# Altium project Shuttler_AMC.PrjPcb (part 2 of 20)

## Sheet USB_SERIAL_QUAD.SchDoc: =ProjectName
size 420 x 297 mm; Author: T.P.; CompanyName: WUT; DrawnBy: T.P.; Organization: WUT ISE; Address1: Warsaw Univeristy of Technology; Address2: Nowowiejska 15/19; DocumentNumber: 21; Revision: 0.9; SheetNumber: 21; SheetTotal: 36; EDA_Number: ARTIQ; Projet: ARTIQ/SINARA; ModifiedBy: -; CreateDate: XX/XX/XXXX; CheckedDate: -; Title2: USB_SERIAL_QUAD.SchDoc; DivGrp: ISE; Designer: G.K. and T.P.; ModifiedDate: -; ProjectName: ADC/DAC MEZZANINE
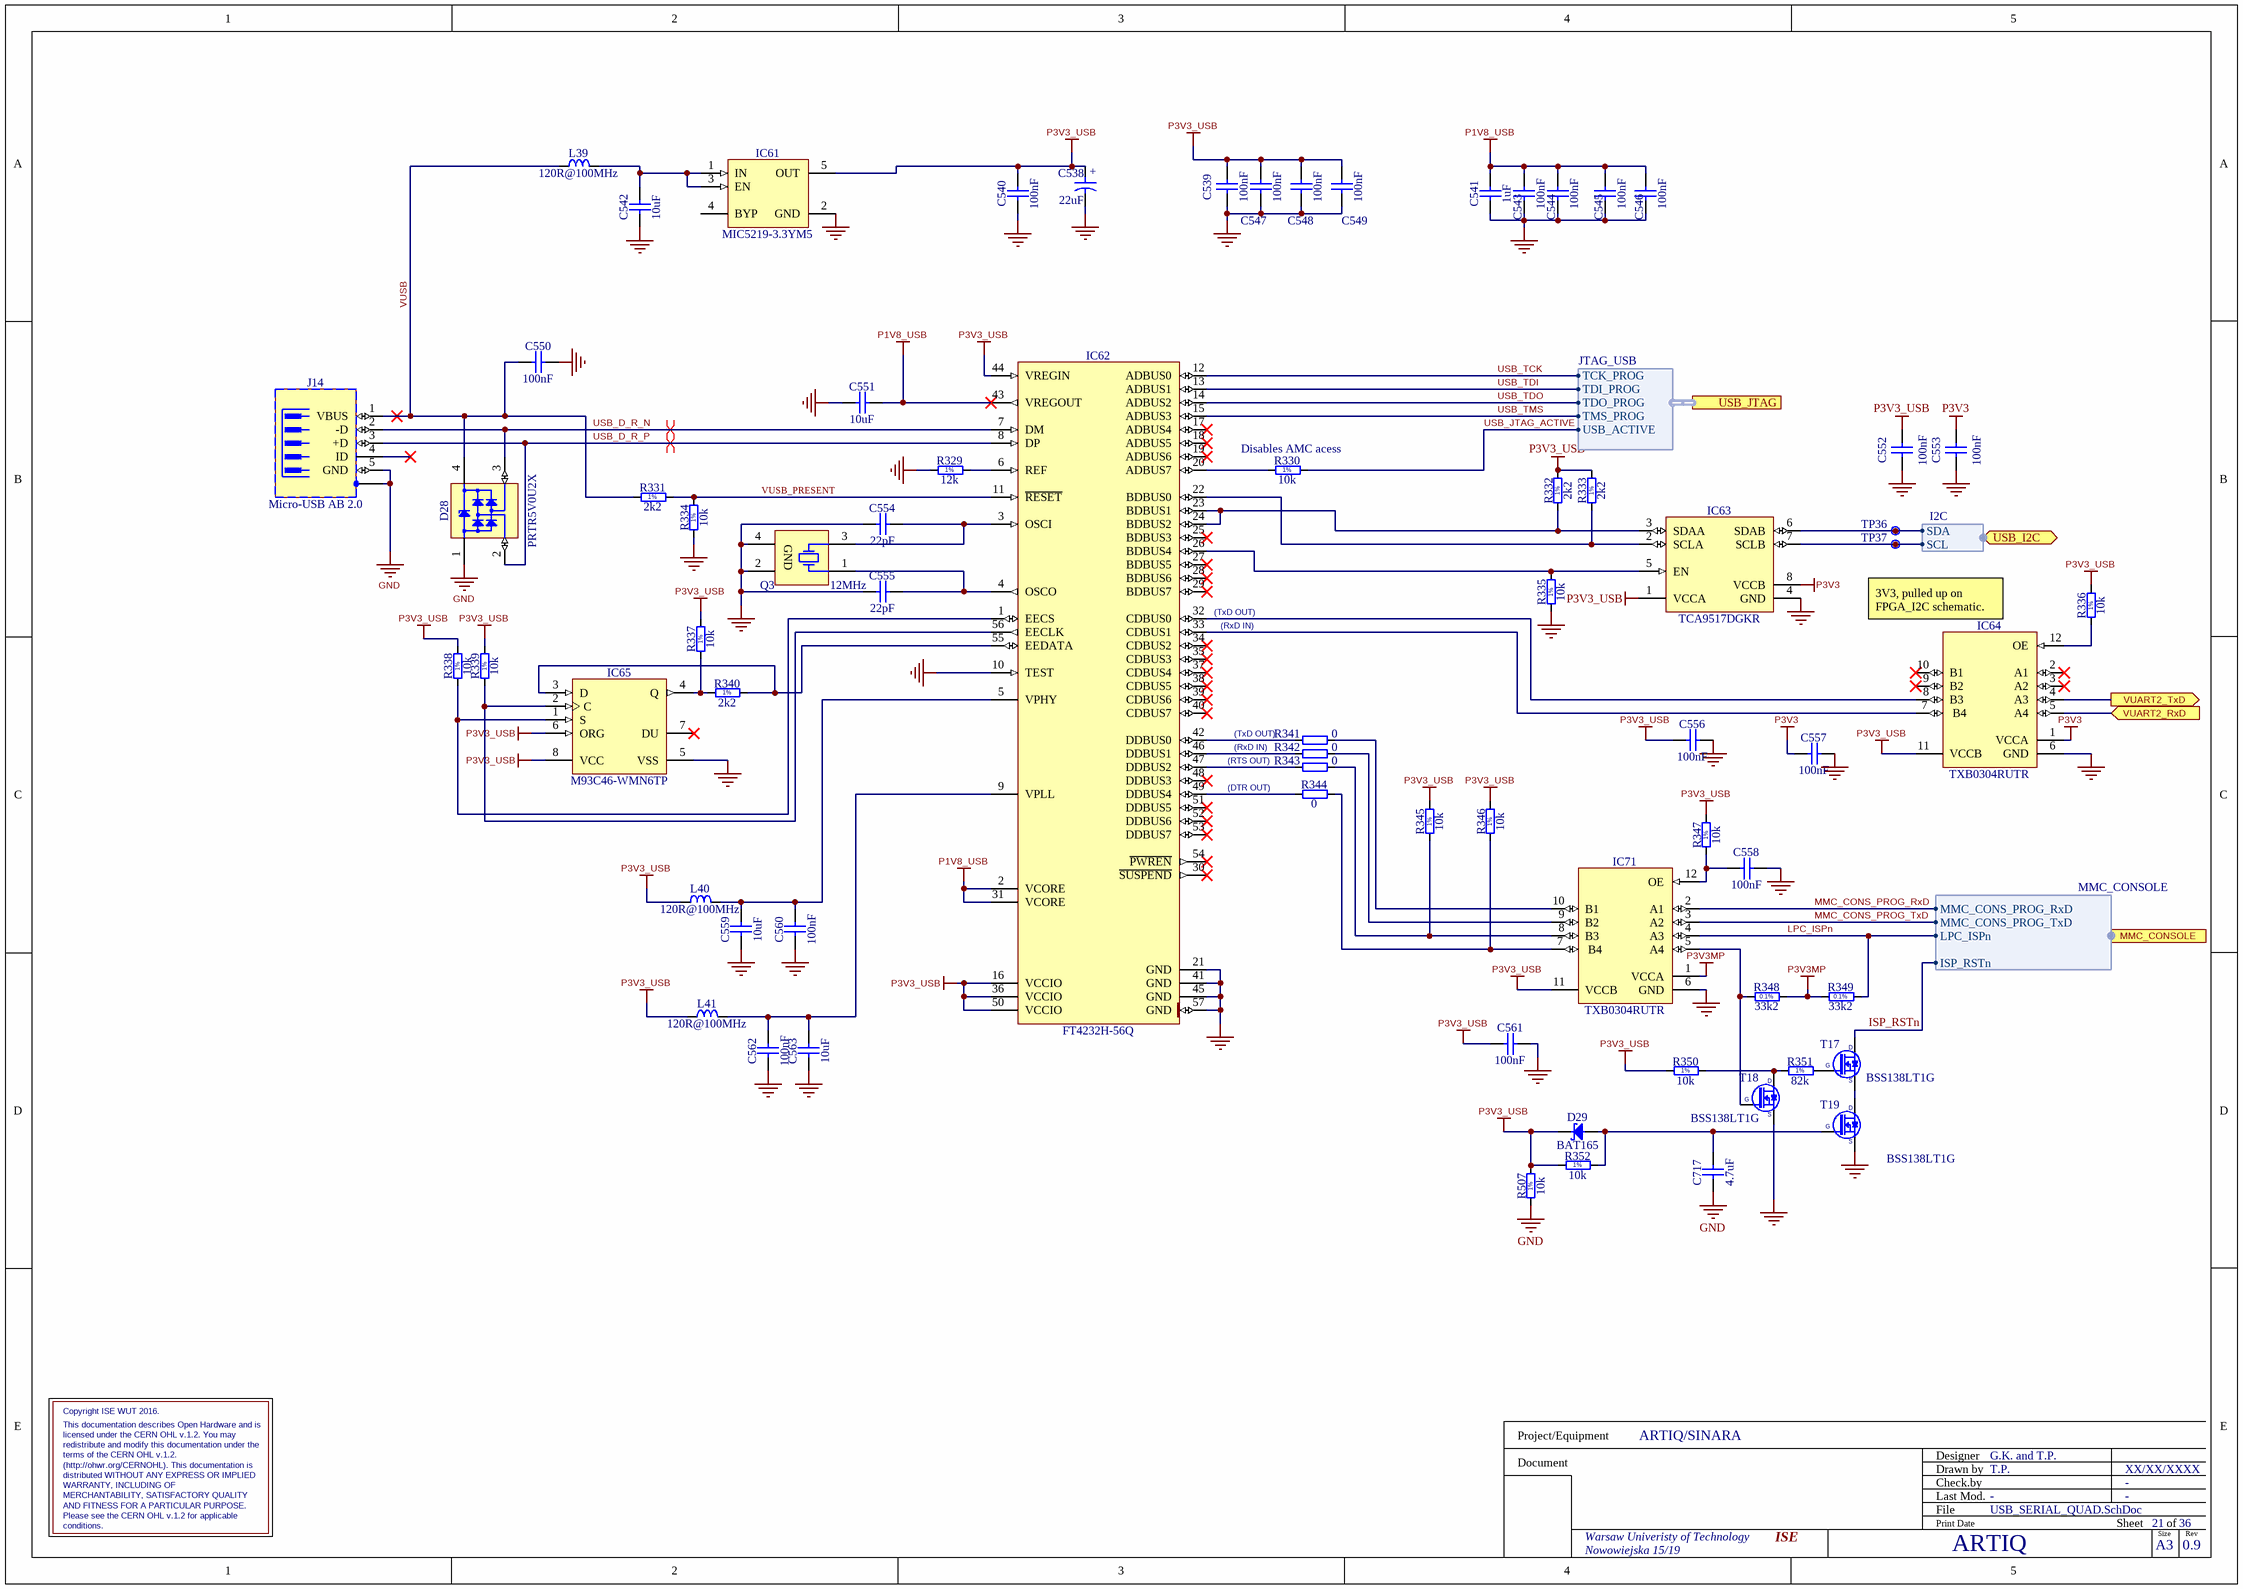
[diagram p1: USB_SERIAL_QUAD.SchDoc]

### Parts
C538  22uF  [CAPMP3216X180N]
C539  100nF  [CAPC0603X33N]
C540  100nF  [CAPC0603X33N]
C541  1uF  [CAPC1005X55N]
C542  10uF  [CAPC1608X87N]
C543  100nF  [CAPC0603X33N]
C544  100nF  [CAPC0603X33N]
C545  100nF  [CAPC0603X33N]
C546  100nF  [CAPC0603X33N]
C547  100nF  [CAPC0603X33N]
C548  100nF  [CAPC0603X33N]
C549  100nF  [CAPC0603X33N]
C550  100nF  [CAPC0603X33N]
C551  10uF  [CAPC1608X87N]
C552  100nF  [CAPC0603X33N]
C553  100nF  [CAPC0603X33N]
C554  22pF  [CAPC1005X55N]
C555  22pF  [CAPC1005X55N]
C556  100nF  [CAPC0603X33N]
C557  100nF  [CAPC0603X33N]
C558  100nF  [CAPC0603X33N]
C559  10uF  [CAPC1608X87N]
C560  100nF  [CAPC0603X33N]
C561  100nF  [CAPC0603X33N]
C562  100nF  [CAPC0603X33N]
C563  10uF  [CAPC1608X87N]
C717  4.7uF  [CAPC1005X55N]
D28  PRTR5V0U2X  [SOT190P230X110-4N]
D29  BAT165  [SOD2512X110N]
IC61  MIC5219-3.3YM5  [SOT95P280X145-5N]
IC62  FT4232H-56Q  [QFN50P800X800X100-57N-S620]
IC63  TCA9517DGKR  [SOP65P490X110-8N]
IC64  TXB0304RUTR  [TEXAS_RUT (R-PUQFN-N12)]
IC65  M93C46-WMN6TP  [SOIC127P600X175-8N]
IC71  TXB0304RUTR  [TEXAS_RUT (R-PUQFN-N12)]
J14  Micro-USB AB 2.0  [HIROSE_ZX62RD-AB-5P8]
L39  120R@100MHz  [INDC1608X65N]
L40  120R@100MHz  [INDC1608X65N]
L41  120R@100MHz  [INDC1608X65N]
Q3  12MHz  [XTAL_TXC_7M]
R329  12k  [RESC1005X40N]
R330  10k  [RESC1005X40N]
R331  2k2  [RESC1005X40N]
R332  2k2  [RESC1005X40N]
R333  2k2  [RESC1005X40N]
R334  10k  [RESC1005X40N]
R335  10k  [RESC1005X40N]
R336  10k  [RESC1005X40N]
R337  10k  [RESC1005X40N]
R338  10k  [RESC1005X40N]
R339  10k  [RESC1005X40N]
R340  2k2  [RESC1005X40N]
R341  0  [RESC1005X40N]
R342  0  [RESC1005X40N]
R343  0  [RESC1005X40N]
R344  0  [RESC1005X40N]
R345  10k  [RESC1005X40N]
R346  10k  [RESC1005X40N]
R347  10k  [RESC1005X40N]
R348  33k2  [RESC1608X55N]
R349  33k2  [RESC1608X55N]
R350  10k  [RESC1005X40N]
R351  82k  [RESC1005X40N]
R352  10k  [RESC1005X40N]
R507  10k  [RESC1005X40N]
T17  BSS138LT1G  [SOT95P240X110-3N]
T18  BSS138LT1G  [SOT95P240X110-3N]
T19  BSS138LT1G  [SOT95P240X110-3N]
TP36  USB I2C SDA  [TPS127]  (value not drawn)
TP37  USB I2C SCL  [TPS127]  (value not drawn)

### Ports
MMC_CONSOLE (harness MMC_CONSOLE), USB_I2C (bidir, harness I2C), USB_JTAG (harness JTAG_USB), VUART2_RxD (in), VUART2_TxD (out)

### Harnesses
JTAG_USB: TDO_PROG, TDI_PROG, TCK_PROG, TMS_PROG, USB_ACTIVE
MMC_CONSOLE: MMC_CONS_PROG_RxD, MMC_CONS_PROG_TxD, LPC_ISPn, ISP_RSTn
I2C: SCL, SDA

### Nets
GND: C538.2 C539.1 C540.1 C541.1 C542.1 C543.1 C544.1 C545.1 C546.1 C547.1 C548.1 C549.1 C550.1 C551.2 C552.1 C553.1 C554.1 C555.1 C556.1 C557.1 C558.1 C559.1 C560.1 C561.1 C562.1 C563.1 C717.1 D28.1(GND) IC61.2(GND) IC62.10(TEST) IC62.21(GND) IC62.41(GND) IC62.45(GND) IC62.57(GND) IC63.4(GND) IC64.6(GND) IC65.5(VSS) IC71.6(GND) J14.5(GND) J14.6(SH) Q3.2(GND) Q3.4(GND) R329.1 R334.1 R335.1 R507.1 T18.2(S) T19.2(S)
P1V8_USB: C541.2 C543.2 C544.2 C545.2 C546.2 C551.1 IC62.2(VCORE) IC62.31(VCORE) IC62.43(VREGOUT)
P3V3: C553.2 C557.2 IC63.8(VCCB) IC64.1(VCCA)
P3V3_USB: C538.1 C539.2 C540.2 C547.2 C548.2 C549.2 C552.2 C556.2 C561.2 D29.1(C) IC61.5(OUT) IC62.16(VCCIO) IC62.36(VCCIO) IC62.44(VREGIN) IC62.50(VCCIO) IC63.1(VCCA) IC64.11(VCCB) IC65.6(ORG) IC65.8(VCC) IC71.11(VCCB) L40.1 L41.1 R332.2 R333.2 R336.2 R337.2 R338.2 R339.2 R345.2 R346.2 R347.2 R350.1 R352.1 R507.2
P3V3MP: IC71.1(VCCA) R348.1 R349.2
FPGA_I2C.SCL: IC63.7(SCLB) TP37.1 ; port USB_I2C.SCL
FPGA_I2C.SDA: IC63.6(SDAB) TP36.1 ; port USB_I2C.SDA
ISP_RSTn: T17.3(D) ; port MMC_CONSOLE.ISP_RSTn  [project net MMC_CONSOLE.ISP_RSTn]
LPC_ISPn: IC71.4(A3) R349.1 ; port MMC_CONSOLE.LPC_ISPn  [project net MMC_CONSOLE.LPC_ISPn]
MMC_CONS_PROG_RxD: IC71.2(A1) ; port MMC_CONSOLE.MMC_CONS_PROG_RxD  [project net MMC_CONSOLE.MMC_CONS_PROG_RxD]
MMC_CONS_PROG_TxD: IC71.3(A2) ; port MMC_CONSOLE.MMC_CONS_PROG_TxD  [project net MMC_CONSOLE.MMC_CONS_PROG_TxD]
PRI_UART_RxD: IC64.4(A3) ; port VUART2_TxD
PRI_UART_TxD: IC64.5(A4) ; port VUART2_RxD
USB_D_R_N: D28.3(I/O2) IC62.7(DM) J14.2(-D)
USB_D_R_P: D28.2(I/O1) IC62.8(DP) J14.3(+D)
USB_JTAG_ACTIVE: R330.1 ; port USB_JTAG.USB_ACTIVE  [project net USB_JTAG.USB_ACTIVE]
USB_TCK: IC62.12(ADBUS0) ; port USB_JTAG.TCK_PROG  [project net USB_JTAG.TCK_PROG]
USB_TDI: IC62.13(ADBUS1) ; port USB_JTAG.TDI_PROG  [project net USB_JTAG.TDI_PROG]
USB_TDO: IC62.14(ADBUS2) ; port USB_JTAG.TDO_PROG  [project net USB_JTAG.TDO_PROG]
USB_TMS: IC62.15(ADBUS3) ; port USB_JTAG.TMS_PROG  [project net USB_JTAG.TMS_PROG]
VUSB: C550.2 D28.4(VCC) J14.1(VBUS) L39.1 R331.1
VUSB_PRESENT: IC62.11(~{RESET}) R331.2 R334.2
NetC542_2: C542.2 IC61.1(IN) IC61.3(EN) L39.2
NetC554_2: C554.2 IC62.3(OSCI) Q3.3(X)
NetC555_2: C555.2 IC62.4(OSCO) Q3.1(X)
NetC558_2: C558.2 IC71.12(OE) R347.1
NetC559_2: C559.2 C560.2 IC62.5(VPHY) L40.2
NetC562_2: C562.2 C563.2 IC62.9(VPLL) L41.2
NetC717_2: C717.2 D29.2(A) R352.2 T19.1(G)
NetIC62_1: IC62.1(EECS) IC65.1(S) R338.1
NetIC62_6: IC62.6(REF) R329.2
NetIC62_20: IC62.20(ADBUS7) R330.2
NetIC62_22: IC62.22(BDBUS0) IC63.2(SCLA) R333.1
NetIC62_23: IC62.23(BDBUS1) IC62.24(BDBUS2) IC63.3(SDAA) R332.1
NetIC62_26: IC62.26(BDBUS4) IC63.5(EN) R335.2
NetIC62_32: IC62.32(CDBUS0) IC64.8(B3)
NetIC62_33: IC62.33(CDBUS1) IC64.7(B4)
NetIC62_42: IC62.42(DDBUS0) R341.1
NetIC62_46: IC62.46(DDBUS1) R342.1
NetIC62_47: IC62.47(DDBUS2) R343.1
NetIC62_49: IC62.49(DDBUS4) R344.1
NetIC62_55: IC62.55(EEDATA) IC65.3(D) R340.2
NetIC62_56: IC62.56(EECLK) IC65.2(C) R339.1
NetIC64_12: IC64.12(OE) R336.1
NetIC65_4: IC65.4(Q) R337.1 R340.1
NetIC71_5: IC71.5(A4) R348.2 T18.1(G)
NetIC71_7: IC71.7(B4) R344.2 R346.1
NetIC71_8: IC71.8(B3) R343.2 R345.1
NetIC71_9: IC71.9(B2) R342.2
NetIC71_10: IC71.10(B1) R341.2
NetR350_2: R350.2 R351.1 T18.3(D)
NetR351_2: R351.2 T17.1(G)
NetT17_2: T17.2(S) T19.3(D)

Not connected (* = marked no-connect by the designer): IC61 4(BYP); IC62 17(ADBUS4)* 18(ADBUS5)* 19(ADBUS6)* 25(BDBUS3)* 27(BDBUS5)* 28(BDBUS6)* 29(BDBUS7)* 30(~{SUSPEND})* 34(CDBUS2)* 35(CDBUS3)* 37(CDBUS4)* 38(CDBUS5)* 39(CDBUS6)* 40(CDBUS7)* 48(DDBUS3)* 51(DDBUS5)* 52(DDBUS6)* 53(DDBUS7)* 54(~{PWREN})*; IC64 2(A1)* 3(A2)* 9(B2)* 10(B1)*; IC65 7(DU)*; J14 4(ID)*

### Layout directives
differential pair; differential pair class Diff_90Ohm: USB_D_R_N, USB_D_R_P

### Notes on the sheet
- (near R330) Disables AMC acess
- (near IC62) (TxD OUT)
- (near IC62) (RxD IN)
- 3V3, pulled up on FPGA_I2C schematic.
- (DTR OUT)
- (RTS OUT)
- (RxD IN)
- (TxD OUT)
- Copyright ISE WUT 2016.
- redistribute and modify this documentation under the
- licensed under the CERN OHL v.1.2. You may
- This documentation describes Open Hardware and is
- (http://ohwr.org/CERNOHL). This documentation is
- distributed WITHOUT ANY EXPRESS OR IMPLIED
- WARRANTY, INCLUDING OF
- terms of the CERN OHL v.1.2.
- AND FITNESS FOR A PARTICULAR PURPOSE.
- conditions.
- MERCHANTABILITY, SATISFACTORY QUALITY
- Please see the CERN OHL v.1.2 for applicable
- Project/Equipment
- Document
- Designer
- Drawn by
- Check.by
- File
- Last Mod.
- Print Date
- Sheet
- Size
- A3
- of
- Rev
- (in symbol CTE3216-18_22UF_6.3V_10%_LESR0900) +
- (in symbol R0402_2K2_1%_0.0625W_100PPM) 1%
- (in symbol R0402_10K_1%_0.0625W_100PPM) 1%
- (in symbol R0402_12K_1%_0.0625W_100PPM) 1%
- (in symbol R0402_82K_1%_0.0625W_100PPM) 1%
- (in symbol R0603_33K2_0.1%_0.063W_10PPM) 0.1%

### Library data of the parts
C538 = CTE3216-18_22UF_6.3V_10%_LESR0900: Polarised capacitor; Manufacturer: GENERIC; Part Description: Low ESR 0R9 Solid Tantalum Chip Capacitor; Manufacturer1 Part Number: TPSA226K006R0900; Tolerance: ±10%; Voltage: 6.3V; Manufacturer Part Number: CTE3216-18_22UF_6.3V_10%_LESR0900; Part Number: CTE3216-18_22UF_6.3V_10%_LESR0900; Value: 22uF; Component Kind: Standard; Component Type: Standard; Pin Count: 2; Status: Preferred; Case: A; Mounted: Yes; Socket: No; SMD: Yes; Sense: No; Manufacturer1 Example: AVX; Manufacturer1 ComponentHeight: 1.8mm; HelpURL: \\cern.ch\dfs\Applications\Altium\Datasheets\CTE-LESR_AVX_TPS.pdf; Author: CERN DEM JLC; CreateDate: 05.05.2008; LatestRevisionDate: 20.01.2009
C539 C540 C543-C550 C556-C558 C560-C562 = CC0201_100NF_6.3V_10%_X5R: as C696 on sheet Shuttler_AMC; Manufacturer Part Number: CC0201_100NF_6.3V_10%_X5R; Part Number: CC0201_100NF_6.3V_10%_X5R; Value: 100nF; Component Kind: Standard; Component Type: Standard; Pin Count: 2; Status: Not Recommended; Case: 0201; Mounted: Yes; Socket: No; SMD: Yes; Sense: No; Manufacturer1 Example: AVX; Manufacturer1 ComponentHeight: 0.33mm; HelpURL: \\cern.ch\dfs\Applications\Altium\Datasheets\CC0201_X5R_AVX.pdf; Author: CERN DEM JLC; CreateDate: 03.12.2007; LatestRevisionDate: 03.12.2007
C541 = CC0402_1UF_16V_10%_X5R: Non-polarised capacitor; Manufacturer: GENERIC; Part Description: SMD Multilayer Chip Ceramic Capacitor; Manufacturer1 Part Number: C1005X5R1C105KT; Tolerance: ±10%; Voltage: 16V; TC: X5R; Manufacturer Part Number: CC0402_1UF_16V_10%_X5R; Part Number: CC0402_1UF_16V_10%_X5R; Value: 1uF; Component Kind: Standard; Component Type: Standard; Pin Count: 2; Status: Preferred; Case: 0402; Mounted: Yes; Socket: No; SMD: Yes; Sense: No; Manufacturer1 Example: TDK; Manufacturer1 ComponentHeight: 0.55mm; HelpURL: \\cern.ch\dfs\Applications\Altium\Datasheets\CC0402_X5R_TDK_C.pdf; Author: CERN DEM JLC; CreateDate: 25.10.2012; LatestRevisionDate: 25.10.2012
C542 C551 C559 C563 = CC0603_10uF_6.3V_20%_X5R: Non-polarised capacitor; Manufacturer: GENERIC; Manufacturer1 Part Number: C0603C106M9PAC; Part Description: SMD Multilayer Chip Ceramic Capacitor; TC: X5R; Tolerance: ±20%; Voltage: 6.3V; Author: CERN DEM JLC; Case: 0603; Component Kind: Standard; Component Type: Standard; CreateDate: 03.12.2007; HelpURL: \\cern.ch\dfs\Applications\Altium\Datasheets\CC0603_X5R_KEMET.pdf; LatestRevisionDate: 03.12.2007; Manufacturer Part Number: CC0603_10uF_6.3V_20%_X5R; Manufacturer1 ComponentHeight: 0.95mm; Manufacturer1 Example: KEMET; Mounted: Yes; Part Number: CC0603_10UF_6.3V_20%_X5R; Pin Count: 2; SMD: Yes; Socket: No; Status: Preferred; Value: 10uF; Sense: No
C552 C553 = CC0201_100NF_6.3V_10%_X5R: Non-polarised capacitor; Part Description: SMD Multilayer Chip Ceramic Capacitor; Manufacturer: GENERIC; Manufacturer1 Part Number: 02016D104KAT2A; Voltage: 6.3V; TC: X5R; Tolerance: ±10%; Part Number: CC0201_100NF_6.3V_10%_X5R; Component Kind: Standard; Component Type: Standard; Pin Count: 2; Value: 100nF; Status: Not Recommended; Manufacturer Part Number: CC0201_100NF_6.3V_10%_X5R; Case: 0201; Mounted: Yes; Socket: No; SMD: Yes; Sense: No; Manufacturer1 Example: AVX; Manufacturer1 ComponentHeight: 0.33mm; HelpURL: \\cern.ch\dfs\Applications\Altium\Datasheets\CC0201_X5R_AVX.pdf; Author: CERN DEM JLC; CreateDate: 2007-12-03; LatestRevisionDate: 2007-12-03
C554 C555 = CC0402_22PF_50V_5%_C0G: Non-polarised capacitor; Manufacturer: GENERIC; Part Description: SMD Multilayer Chip Ceramic Capacitor; Manufacturer1 Part Number: C0402C220J5GACTU; Tolerance: ±5%; Voltage: 50V; TC: C0G/NP0; Manufacturer Part Number: CC0402_22PF_50V_5%_C0G; Part Number: CC0402_22PF_50V_5%_C0G; Value: 22pF; Component Kind: Standard; Component Type: Standard; Pin Count: 2; Status: Preferred; Case: 0402; Mounted: Yes; Socket: No; SMD: Yes; Sense: No; Manufacturer1 Example: KEMET; Manufacturer1 ComponentHeight: 0.55mm; HelpURL: \\cern.ch\dfs\Applications\Altium\Datasheets\CC0805_C0G_KEMET_(Commercial Grade).pdf; Author: CERN DEM JLC; CreateDate: 03.12.2007; LatestRevisionDate: 03.12.2007
C717 = CC0402_4.7UF_6.3V_20%_X5R: Non-polarised capacitor; Manufacturer: GENERIC; Part Description: SMD Multilayer Chip Ceramic Capacitor; Manufacturer1 Part Number: C1005X5R0J475M050BC; Tolerance: ±20%; Voltage: 6.3V; TC: X5R; Manufacturer Part Number: CC0402_4.7UF_6.3V_20%_X5R; Part Number: CC0402_4.7UF_6.3V_20%_X5R; Value: 4.7uF; Component Kind: Standard; Component Type: Standard; Pin Count: 2; Status: Preferred; Case: 0402; Mounted: Yes; Socket: No; SMD: Yes; Sense: No; Manufacturer1 Example: TDK; Manufacturer1 ComponentHeight: 0.65mm; HelpURL: \\cern.ch\dfs\Applications\Altium\Datasheets\CC0402_X5R_TDK_C.pdf; Author: CERN DEM JLC; CreateDate: 03.03.2015; LatestRevisionDate: 03.03.2015
D28 = PRTR5V0U2X: Ultra Low Capacitance Double Rail-to-Rail ESD Protection Diode; Manufacturer: NXP SEMICONDUCTORS; Part Description: Ultra Low Capacitance (1pF) Double Rail-to-Rail ESD Protection Diode (8kV); Voltage: 5.5V; PressFit: No; Bonding: No; Manufacturer Part Number: PRTR5V0U2X; PackageDescription: SOT143B, SOT, 1.90mm Pitch; 4 Pin, 1.30mm W X 2.90mm L X 1.10mm H body, IPC Medium Density; Part Number: PRTR5V0U2X; Component Kind: Standard; Component Type: Standard; Device: PRTR5V0U2X; Pin Count: 4; Case: SOT143B; Mounted: Yes; Socket: No; SMD: Yes; Sense: No; ComponentHeight: 1.1mm; HelpURL: \\cern.ch\dfs\Applications\Altium\Datasheets\PRTR5V0U2X.pdf; Author: CERN DEM JLC; CreateDate: 22.03.2011; LatestRevisionDate: 22.03.2011
D29 = BAT165: Schottky Diode; Manufacturer: INFINEON; Part Description: Medium Power AF Schottky Diode; Voltage: 40V; Power: 750mA; PressFit: No; Bonding: No; Manufacturer Part Number: BAT165; PackageDescription: Small Outline Diode (SOD-323), 1.70mm W X 1.25mm L X 1.10mm H body,  IPC Medium Density; Part Number: BAT165; Component Kind: Standard; Component Type: Standard; Device: BAT165; Pin Count: 2; Case: SOD323; Mounted: Yes; Socket: No; SMD: Yes; Sense: No; ComponentHeight: 1.1mm; HelpURL: \\cern.ch\dfs\Applications\Altium\Datasheets\BAT165.pdf; Author: CERN DEM JLC; CreateDate: 12.11.2014; LatestRevisionDate: 12.11.2014
IC61 = MIC5219-3.3YM5: 500mA Peak Output LDO Regulator; Part Description: 3.3V 500mA Peak Output Low Drop-Out  (LDO) Regulator; Manufacturer: MICROCHIP TECHNOLOGY; PressFit: No; Bonding: No; Part Number: MIC5219-3.3YM5; Component Kind: Standard; Component Type: Standard; Device: MIC5219-3.3YM5; PackageDescription: SOT, 0.95mm pitch; 5 pin, 1.60mm W X 2.90mm L X 1.45mm H body, IPC Medium Density; Manufacturer Part Number: MIC5219-3.3YM5; Pin Count: 5; Case: SOT23-5; Mounted: Yes; Socket: No; SMD: Yes; Sense: No; ComponentHeight: 1.45mm; HelpURL: \\cern.ch\dfs\Applications\Altium\Datasheets\MIC5219-3.3YM5.pdf; Author: CERN DEM WB; CreateDate: 16.04.2019; LatestRevisionDate: 16.04.2019
IC62 = FT4232H-56Q: Quad High Speed USB to Multipurpose UART/MPSSE IC; Manufacturer: FUTURE TECHNOLOGY DEVICES INTERNATIONAL (FTDI); PressFit: No; Bonding: No; Manufacturer Part Number: FT4232H-56Q; PackageDescription: QFN, 0.50mm Pitch, Square; 56 Pin, 8.00mm L X 8.00mm W X 1.00mm H body (6.1mm X 6.1mm Thermal tab), IPC Medium Density; Part Description: Quad High Speed USB to Multipurpose UART/MPSSE IC; Part Number: FT4232H-56Q; Component Kind: Standard; Component Type: Standard; Device: FT4232H-56Q; Pin Count: 57; Case: QFN56; Mounted: Yes; Socket: No; SMD: Yes; Sense: No; ComponentHeight: 1mm; Author: CERN DEM JLC; HelpURL: \\cern.ch\dfs\Applications\Altium\Datasheets\FT4232H-56Q.pdf; CreateDate: 11.10.2016; LatestRevisionDate: 11.10.2016
IC63 = TCA9517DGKR: Level-Translating I2C Bus Repeater; Manufacturer: TEXAS INSTRUMENTS; PressFit: No; Bonding: No; Part Number: TCA9517DGKR; Component Kind: Standard; Component Type: Standard; Device: TCA9517DGKR; PackageDescription: SOP, 0.65mm, Pitch; 8 Pin, 3.0mm W X 3.0mm L X 1.10mm H Body, IPC Medium Density; Part Description: Level-Translating I2C Bus Repeater; Manufacturer Part Number: TCA9517DGKR; Pin Count: 8; Case: TSSOP8; Mounted: Yes; Socket: No; SMD: Yes; Sense: No; ComponentHeight: 1.1mm; Author: CERN DEM JLC; HelpURL: \\cern.ch\dfs\Applications\Altium\Datasheets\TCA9517DGKR.pdf; CreateDate: 07.07.2014; LatestRevisionDate: 07.07.2014
IC64 IC71 = TXB0304RUTR: 4-bit Bidirectional Auto-direction Sensing Translator with Fully Symmetric 0.9V to 3.6V Range; Manufacturer: TEXAS INSTRUMENTS; PressFit: No; Bonding: No; Manufacturer Part Number: TXB0304RUTR; PackageDescription: SON, TEXAS RUT (R-PUQFN-N12), 0.50mm Pitch, 12-pin, 1.70mm W  X 2.00mm L X 0.55mm Height; Part Description: 4-bit Bidirectional Auto-direction Sensing Translator with Fully Symmetric 0.9V to 3.6V Range; Part Number: TXB0304RUTR; Component Kind: Standard; Component Type: Standard; Device: TXB0304RUTR; Pin Count: 12; Case: QFN12; Mounted: Yes; Socket: No; SMD: Yes; Sense: No; ComponentHeight: 0.55mm; Author: CERN DEM JLC; HelpURL: \\cern.ch\dfs\Applications\Altium\Datasheets\TXB0304RUTR.pdf; CreateDate: 27.10.2014; LatestRevisionDate: 28.10.2014
IC65 = M93C46-WMN6TP: 2.5 to 5.5 V, 1Kb (128x8) Serial Microwire Bus EEPROM; Manufacturer: ST MICROELECTRONICS; Part Description: 1Kbit (128 x 8 bit or 64 x 16 bit) MICROWIRE® Serial Access EEPROM; PressFit: No; Bonding: No; Manufacturer Part Number: M93C46-WMN6TP; PackageDescription: SOIC 8, Pitch 1.27mm - Body 4x5mm, IPC Medium Density; Part Number: M93C46-WMN6TP; Component Kind: Standard; Component Type: Standard; Device: M93C46-WMN6TP; Pin Count: 8; Case: SOIC8; Mounted: Yes; Socket: No; SMD: Yes; Sense: No; ComponentHeight: 1.75mm; HelpURL: \\cern.ch\dfs\Applications\Altium\Datasheets\M93C46-WMN6TP.pdf; Author: CERN DEM JLC; CreateDate: 15.11.2012; LatestRevisionDate: 15.11.2012
J14 = HIROSE_ZX62RD-AB-5P8: 5 Pin + 1 Shield USB Receptacle; Manufacturer: HIROSE (HRS); Part Description: Micro-USB 2.0 Right Angle, SMD Type AB - Reverse (Top mount), Shell Through Hole; PressFit: No; Manufacturer Part Number: ZX62RD-AB-5P8; Part Number: HIROSE_ZX62RD-AB-5P8; Component Kind: Standard; Component Type: Standard; Pin Count: 7; Family: Micro-USB AB 2.0; Mounted: Yes; Socket: No; SMD: Yes; Sense: No; Status: Obsolete; ComponentHeight: 2.35mm; HelpURL: \\cern.ch\dfs\Applications\Altium\Datasheets\HIROSE_ZX62RD-AB-5P8.pdf; ComponentLink1URL: \\cern.ch\dfs\Applications\Altium\Datasheets\HIROSE_ZX62RD-AB-5P8_Package-Drawing.pdf; ComponentLink1Description: Package-Drawing; Author: CERN DEM JLC; CreateDate: 29.10.2014; LatestRevisionDate: 22.06.2017
L39-L41 = IND0603_MURATA_BLM18SG121TN1D: Inductor; Manufacturer: MURATA; Part Description: SMD EMIFIL Suppression Chip Ferrite Bead; Tolerance: ±25%; Power: 3A; Resistance: 0.025R; Manufacturer Part Number: BLM18SG121TN1D; Part Number: IND0603_MURATA_BLM18SG121TN1D; Value: 120R@100MHz; Component Kind: Standard; Component Type: Standard; Pin Count: 2; Status: None; Case: 0603; Mounted: Yes; Socket: No; SMD: Yes; Sense: No; ComponentHeight: 0.65mm; HelpURL: \\cern.ch\dfs\Applications\Altium\Datasheets\IND0603_MURATA_BLM18S.pdf; Author: CERN DEM JLC; CreateDate: 23.07.2014; LatestRevisionDate: 23.07.2014
Q3 = XTAL_12MHZ_TXC_7M-12.000MAAJ-T: Crystal 4 pins 1=XTAL Control 2=GND3=XTAL 4=GND; Manufacturer: TXC CORPORATION; Part Description: ±30ppm 18pF -20°C to +70°C  4 Pins, 3.2x2.5X0.8mm, SMD Sealing Crystal, 7M Series; PressFit: No; Bonding: No; Manufacturer Part Number: 7M-12.000MAAJ-T; PackageDescription: 4 Pins, 2.5x3.2mm, SMD Sealing Crystal, 7M Serie; Part Number: XTAL_12MHZ_TXC_7M-12.000MAAJ-T; Value: 12MHz; Component Kind: Standard; Component Type: Standard; Pin Count: 4; Mounted: Yes; Socket: No; SMD: Yes; Sense: No; ComponentHeight: 0.8mm; HelpURL: \\cern.ch\dfs\Applications\Altium\Datasheets\XTAL_TXC_7M.pdf; Author: CERN DEM JLC; CreateDate: 19.06.2012; LatestRevisionDate: 19.06.2012
R329 = R0402_12K_1%_0.0625W_100PPM: Resistor - 1%; Manufacturer: GENERIC; Part Description: General Purpose Thick Film Chip Resistor; Manufacturer1 Part Number: 232270671203L; TC: ±100ppm/°C; PressFit: No; Manufacturer Part Number: R0402_12K_1%_0.0625W_100PPM; Part Number: R0402_12K_1%_0.0625W_100PPM; Tolerance: ±1%; Value: 12k; Component Kind: Standard; Component Type: Standard; Pin Count: 2; Status: Not Recommended; Power: 0.0625W; Case: 0402; Mounted: Yes; Sense: No; Socket: No; SMD: Yes; Manufacturer1 Example: YAGEO PHYCOMP; Manufacturer1 ComponentHeight: 0.4mm; HelpURL: \\cern.ch\dfs\Applications\Altium\Datasheets\R0402_Phycomp_RC0402.pdf; Author: CERN DEM JLC; CreateDate: 03.12.2007; LatestRevisionDate: 17.10.2012
R330 R334 R336-R339 R345-R347 R350 R352 R507 = R0402_10K_1%_0.0625W_100PPM: Resistor - 1%; Manufacturer: GENERIC; Part Description: General Purpose Thick Film Chip Resistor; Manufacturer1 Part Number: 232270671003L; TC: ±100ppm/°C; PressFit: No; Manufacturer Part Number: R0402_10K_1%_0.0625W_100PPM; Part Number: R0402_10K_1%_0.0625W_100PPM; Tolerance: ±1%; Value: 10k; Component Kind: Standard; Component Type: Standard; Pin Count: 2; Status: Not Recommended; Power: 0.0625W; Case: 0402; Mounted: Yes; Sense: No; Socket: No; SMD: Yes; Manufacturer1 Example: YAGEO PHYCOMP; Manufacturer1 ComponentHeight: 0.4mm; HelpURL: \\cern.ch\dfs\Applications\Altium\Datasheets\R0402_Phycomp_RC0402.pdf; Author: CERN DEM JLC; CreateDate: 03.12.2007; LatestRevisionDate: 17.10.2012
R331 R340 = R0402_2K2_1%_0.0625W_100PPM: Resistor - 1%; Manufacturer: GENERIC; Part Description: General Purpose Thick Film Chip Resistor; Manufacturer1 Part Number: 232270672202L; TC: ±100ppm/°C; PressFit: No; Manufacturer Part Number: R0402_2K2_1%_0.0625W_100PPM; Part Number: R0402_2K2_1%_0.0625W_100PPM; Tolerance: ±1%; Value: 2k2; Component Kind: Standard; Component Type: Standard; Pin Count: 2; Status: Not Recommended; Power: 0.0625W; Case: 0402; Mounted: Yes; Sense: No; Socket: No; SMD: Yes; Manufacturer1 Example: YAGEO PHYCOMP; Manufacturer1 ComponentHeight: 0.4mm; HelpURL: \\cern.ch\dfs\Applications\Altium\Datasheets\R0402_Phycomp_RC0402.pdf; Author: CERN DEM JLC; CreateDate: 03.12.2007; LatestRevisionDate: 17.10.2012
R332 R333 = R0402_2K2_1%_0.0625W_100PPM: Resistor - 1%; Part Description: General Purpose Thick Film Chip Resistor; Manufacturer: GENERIC; Manufacturer1 Part Number: 232270672202L; TC: ±100ppm/°C; PressFit: No; Part Number: R0402_2K2_1%_0.0625W_100PPM; Component Kind: Standard; Component Type: Standard; Pin Count: 2; Value: 2k2; Status: Not Recommended; Power: 0.0625W; Tolerance: ±1%; Manufacturer Part Number: R0402_2K2_1%_0.0625W_100PPM; Case: 0402; Mounted: Yes; Sense: No; Socket: No; SMD: Yes; Manufacturer1 Example: YAGEO PHYCOMP; Manufacturer1 ComponentHeight: 0.4mm; HelpURL: \\cern.ch\dfs\Applications\Altium\Datasheets\R0402_Phycomp_RC0402.pdf; Author: CERN DEM JLC; CreateDate: 03.12.2007; LatestRevisionDate: 17.10.2012
R335 = R0402_10K_1%_0.0625W_100PPM: Resistor - 1%; Part Description: General Purpose Thick Film Chip Resistor; Manufacturer: GENERIC; Manufacturer1 Part Number: 232270671003L; TC: ±100ppm/°C; PressFit: No; Part Number: R0402_10K_1%_0.0625W_100PPM; Component Kind: Standard; Component Type: Standard; Pin Count: 2; Value: 10k; Status: Not Recommended; Power: 0.0625W; Tolerance: ±1%; Manufacturer Part Number: R0402_10K_1%_0.0625W_100PPM; Case: 0402; Mounted: Yes; Sense: No; Socket: No; SMD: Yes; Manufacturer1 Example: YAGEO PHYCOMP; Manufacturer1 ComponentHeight: 0.4mm; HelpURL: \\cern.ch\dfs\Applications\Altium\Datasheets\R0402_Phycomp_RC0402.pdf; Author: CERN DEM JLC; CreateDate: 03.12.2007; LatestRevisionDate: 17.10.2012
R341-R344 = R0402_0R_JUMPER: as R313 on sheet Shuttler_AMC; Manufacturer Part Number: R0402_0R_JUMPER; Part Number: R0402_0R_JUMPER; Value: 0; Component Kind: Standard; Component Type: Standard; Pin Count: 2; Status: Not Recommended; Case: 0402; Mounted: Yes; Sense: No; Socket: No; SMD: Yes; Manufacturer1 Example: YAGEO PHYCOMP; Manufacturer1 ComponentHeight: 0.4mm; HelpURL: \\cern.ch\dfs\Applications\Altium\Datasheets\R0402_Phycomp_RC0402.pdf; Author: CERN DEM JLC; CreateDate: 03.12.2007; LatestRevisionDate: 17.10.2012
R348 R349 = R0603_33K2_0.1%_0.063W_10PPM: Resistor - 0.1%; Manufacturer: GENERIC; Part Description: Thin Film Chip Resistor; Manufacturer1 Part Number: RN73C1J33K2BTDF; Power: 0.063W; TC: ±10ppm; PressFit: No; Manufacturer Part Number: R0603_33K2_0.1%_0.063W_10PPM; Part Number: R0603_33K2_0.1%_0.063W_10PPM; Tolerance: ±0.1%; Value: 33k2; Component Kind: Standard; Component Type: Standard; Pin Count: 2; Status: Not Recommended; Case: 0603; Mounted: Yes; Sense: No; Socket: No; SMD: Yes; Manufacturer1 Example: TYCO HOLSWORTHY; Manufacturer1 ComponentHeight: 0.5mm; HelpURL: \\cern.ch\dfs\Applications\Altium\Datasheets\R0603_Tyco_RN73.pdf; Author: CERN DEM JLC; CreateDate: 03.12.2007; LatestRevisionDate: 13.03.2008
R351 = R0402_82K_1%_0.0625W_100PPM: Resistor - 1%; Part Description: General Purpose Thick Film Chip Resistor; Manufacturer: GENERIC; Manufacturer1 Part Number: 232270678203L; TC: ±100ppm/°C; PressFit: No; Part Number: R0402_82K_1%_0.0625W_100PPM; Component Kind: Standard; Component Type: Standard; Pin Count: 2; Value: 82k; Status: Not Recommended; Power: 0.0625W; Tolerance: ±1%; Manufacturer Part Number: R0402_82K_1%_0.0625W_100PPM; Case: 0402; Mounted: Yes; Sense: No; Socket: No; SMD: Yes; Manufacturer1 Example: YAGEO PHYCOMP; Manufacturer1 ComponentHeight: 0.4mm; HelpURL: \\cern.ch\dfs\Applications\Altium\Datasheets\R0402_Phycomp_RC0402.pdf; Author: CERN DEM JLC; CreateDate: 03.12.2007; LatestRevisionDate: 17.10.2012
T17-T19 = BSS138LT1G: N-CHANNEL MOSFET WITH DIODE; Part Description: 50V 200mA N-Channel Enhancement Mode Field-Effect Transistor; Manufacturer: ON SEMICONDUCTOR; PressFit: No; Bonding: No; Part Number: BSS138LT1G; Component Kind: Standard; Component Type: Standard; Device: BSS138LT1G; PackageDescription: SOT23 3-Leads, Pitch 0.95mm - Body 1.4x3mm, IPC Medium Density; Manufacturer Part Number: BSS138LT1G; Pin Count: 3; Case: SOT23-3; Mounted: Yes; Socket: No; SMD: Yes; Sense: No; ComponentHeight: 1.11mm; HelpURL: \\cern.ch\dfs\Applications\Altium\Datasheets\BSS138LT1G.pdf; Author: CERN DEM JLC; CreateDate: 23.03.2009; LatestRevisionDate: 23.03.2009
TP36 TP37 = SMD_PAD_1.27X1.27MM: Test Point; Part Description: 1.27mm x 1.27mm PCB Copper Area (SMD Test Point); Mounted: No; Part Number: SMD_PAD_1.27X1.27MM; Component Kind: Standard (No BOM); Component Type: Standard (No BOM); Pin Count: 1; Family: Test Point; Socket: No; SMD: Yes; Sense: No; Status: None; ComponentHeight: 0mm; HelpURL: Undefined; Author: CERN DEM JLC; CreateDate: 12.01.2008; LatestRevisionDate: 12.01.2008; PackageDescription: 1.27mm x 1.27mm PCB Copper Area (SMD Test Point)

## Sheet AMC_Connector.SchDoc: =ProjectName
size 420 x 297 mm; Author: T.P.; CompanyName: WUT; DrawnBy: T.P.; Organization: WUT ISE; Address1: Warsaw Univeristy of Technology; Address2: Nowowiejska 15/19; DocumentNumber: 35; Revision: 0.9; SheetNumber: 35; SheetTotal: 36; EDA_Number: ARTIQ; Projet: ARTIQ/SINARA; ModifiedBy: -; CreateDate: XX/XX/XXXX; CheckedDate: -; Title2: AMC_Connector.SchDoc; DivGrp: ISE; Designer: G.K. and T.P.; ModifiedDate: -; ProjectName: ADC/DAC MEZZANINE
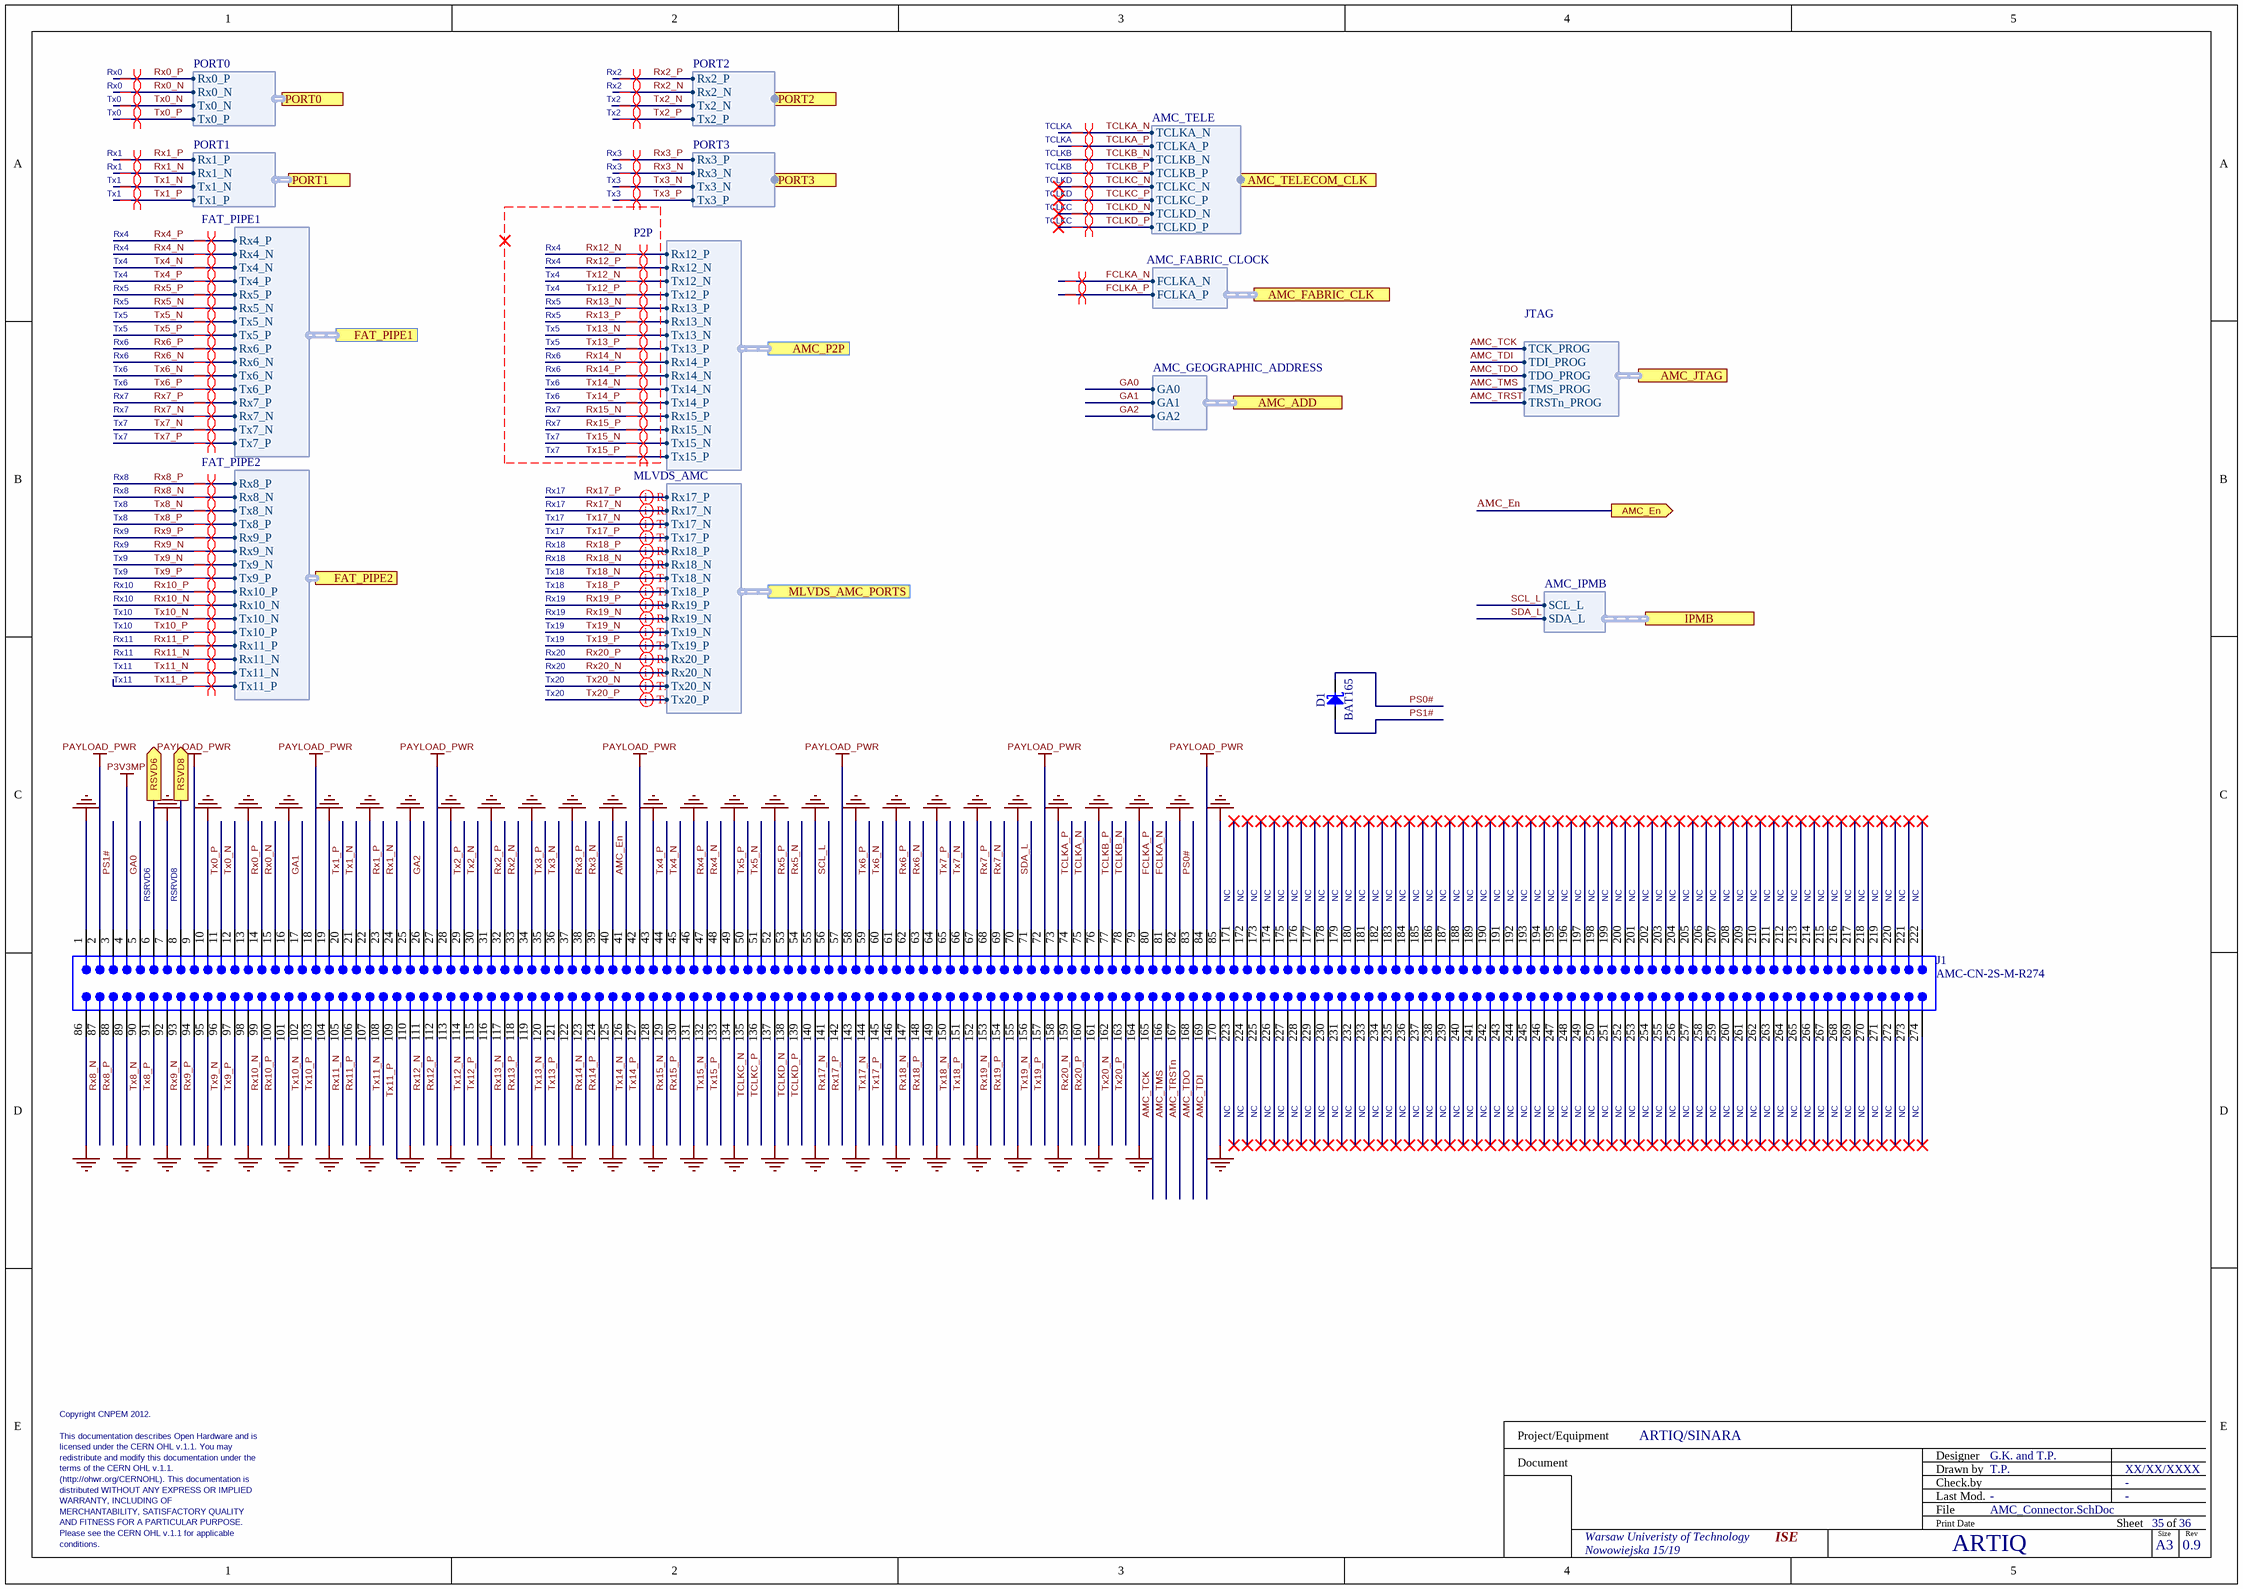
[diagram p2: AMC_Connector.SchDoc]

### Parts
D1  BAT165  [SOD2512X110N]
J1  AMC-CN-2S-M-R274  [AMC-GF-2D-750-O274]  (no BOM)

### Ports
AMC_ADD (harness AMC_GEOGRAPHIC_ADDRESS), AMC_En (out), AMC_FABRIC_CLK (harness AMC_FABRIC_CLOCK), AMC_JTAG (harness JTAG), AMC_P2P (harness P2P), AMC_TELECOM_CLK (harness AMC_TELE), FAT_PIPE1 (harness FAT_PIPE1), FAT_PIPE2 (harness FAT_PIPE2), IPMB (harness AMC_IPMB), MLVDS_AMC_PORTS (harness MLVDS_AMC), PORT0 (harness PORT0), PORT1 (harness PORT1), PORT2 (harness PORT2), PORT3 (harness PORT3), RSVD6 (out), RSVD8 (out)

### Harnesses
PORT0: Rx0_P, Rx0_N, Tx0_N, Tx0_P
PORT1: Rx1_P, Rx1_N, Tx1_N, Tx1_P
FAT_PIPE1: Rx4_P, Rx4_N, Tx4_N, Tx4_P, Rx5_P, Rx5_N, Tx5_N, Tx5_P, Rx6_P, Rx6_N, Tx6_N, Tx6_P, Rx7_P, Rx7_N, Tx7_N, Tx7_P
PORT2: Rx2_P, Rx2_N, Tx2_N, Tx2_P
PORT3: Rx3_P, Rx3_N, Tx3_N, Tx3_P
FAT_PIPE2: Rx8_P, Rx8_N, Tx8_N, Tx8_P, Rx9_P, Rx9_N, Tx9_N, Tx9_P, Rx10_P, Rx10_N, Tx10_N, Tx10_P, Rx11_P, Rx11_N, Tx11_N, Tx11_P
P2P: Rx12_P, Rx12_N, Tx12_N, Tx12_P, Rx13_P, Rx13_N, Tx13_N, Tx13_P, Rx14_P, Rx14_N, Tx14_N, Tx14_P, Rx15_P, Rx15_N, Tx15_N, Tx15_P
MLVDS_AMC: Rx17_P, Rx17_N, Tx17_N, Tx17_P, Rx18_P, Rx18_N, Tx18_N, Tx18_P, Rx19_P, Rx19_N, Tx19_N, Tx19_P, Rx20_P, Rx20_N, Tx20_N, Tx20_P
AMC_GEOGRAPHIC_ADDRESS: GA0, GA1, GA2
AMC_IPMB: SCL_L, SDA_L
JTAG: TDO_PROG, TDI_PROG, TCK_PROG, TMS_PROG, TRSTn_PROG
AMC_FABRIC_CLOCK: FCLKA_N, FCLKA_P
AMC_TELE: TCLKA_N, TCLKA_P, TCLKB_N, TCLKB_P, TCLKC_N, TCLKC_P, TCLKD_N, TCLKD_P

### Nets
GND: J1.1 J1.7 J1.10 J1.13 J1.16 J1.19 J1.22 J1.25 J1.28 J1.31 J1.34 J1.37 J1.40 J1.43 J1.46 J1.49 J1.52 J1.55 J1.58 J1.61 J1.64 J1.67 J1.70 J1.73 J1.76 J1.79 J1.82 J1.85 J1.86 J1.89 J1.92 J1.95 J1.98 J1.101 J1.104 J1.107 J1.110 J1.113 J1.116 J1.119 J1.122 J1.125 J1.128 J1.131 J1.134 J1.137 J1.140 J1.143 J1.146 J1.149 J1.152 J1.155 J1.158 J1.161 J1.164 J1.170
P3V3MP: J1.4
PAYLOAD_PWR: J1.2 J1.9 J1.18 J1.27 J1.42 J1.57 J1.72 J1.84
AMC_En: J1.41 ; port AMC_En
AMC_TCK: J1.165 ; port AMC_JTAG.TCK_PROG  [project net AMC_JTAG.TCK_PROG]
AMC_TDI: J1.169 ; port AMC_JTAG.TDI_PROG  [project net AMC_JTAG.TDI_PROG]
AMC_TDO: J1.168 ; port AMC_JTAG.TDO_PROG  [project net AMC_JTAG.TDO_PROG]
AMC_TMS: J1.166 ; port AMC_JTAG.TMS_PROG  [project net AMC_JTAG.TMS_PROG]
AMC_TRSTn: J1.167 ; port AMC_JTAG.TRSTn_PROG  [project net AMC_JTAG.TRSTn_PROG]
FCLKA_N: J1.81 ; port AMC_FABRIC_CLK.FCLKA_N  [project net AMC_FABRIC_CLOCK.FCLKA_N]
FCLKA_P: J1.80 ; port AMC_FABRIC_CLK.FCLKA_P  [project net AMC_FABRIC_CLOCK.FCLKA_P]
GA0: J1.5 ; port AMC_ADD.GA0  [project net AMC_ADD.GA0]
GA1: J1.17 ; port AMC_ADD.GA1  [project net AMC_ADD.GA1]
GA2: J1.26 ; port AMC_ADD.GA2  [project net AMC_ADD.GA2]
PS0#: D1.1(C) J1.83
PS1#: D1.2(A) J1.3
Rx0_N: J1.15 ; port PORT0.Rx0_N  [project net PORT0.Rx0_N]
Rx0_P: J1.14 ; port PORT0.Rx0_P  [project net PORT0.Rx0_P]
Rx1_N: J1.24 ; port PORT1.Rx1_N
Rx1_P: J1.23 ; port PORT1.Rx1_P
Rx2_N: J1.33 ; port PORT2.Rx2_N
Rx2_P: J1.32 ; port PORT2.Rx2_P
Rx3_N: J1.39 ; port PORT3.Rx3_N
Rx3_P: J1.38 ; port PORT3.Rx3_P
Rx4_N: J1.48 ; port FAT_PIPE1.Rx4_N  [project net FAT_PIPE1.Rx4_N]
Rx4_P: J1.47 ; port FAT_PIPE1.Rx4_P  [project net FAT_PIPE1.Rx4_P]
Rx5_N: J1.54 ; port FAT_PIPE1.Rx5_N  [project net FAT_PIPE1.Rx5_N]
Rx5_P: J1.53 ; port FAT_PIPE1.Rx5_P  [project net FAT_PIPE1.Rx5_P]
Rx6_N: J1.63 ; port FAT_PIPE1.Rx6_N  [project net FAT_PIPE1.Rx6_N]
Rx6_P: J1.62 ; port FAT_PIPE1.Rx6_P  [project net FAT_PIPE1.Rx6_P]
Rx7_N: J1.69 ; port FAT_PIPE1.Rx7_N  [project net FAT_PIPE1.Rx7_N]
Rx7_P: J1.68 ; port FAT_PIPE1.Rx7_P  [project net FAT_PIPE1.Rx7_P]
Rx8_N: J1.87 ; port FAT_PIPE2.Rx8_N
Rx8_P: J1.88 ; port FAT_PIPE2.Rx8_P
Rx9_N: J1.93 ; port FAT_PIPE2.Rx9_N
Rx9_P: J1.94 ; port FAT_PIPE2.Rx9_P
Rx10_N: J1.99 ; port FAT_PIPE2.Rx10_N
Rx10_P: J1.100 ; port FAT_PIPE2.Rx10_P
Rx11_N: J1.105 ; port FAT_PIPE2.Rx11_N
Rx11_P: J1.106 ; port FAT_PIPE2.Rx11_P
Rx12_N: J1.111 ; port AMC_P2P.Rx12_P  [project net AMC_P2P.Rx12_P]
Rx12_P: J1.112 ; port AMC_P2P.Rx12_N  [project net AMC_P2P.Rx12_N]
Rx13_N: J1.117 ; port AMC_P2P.Rx13_P  [project net AMC_P2P.Rx13_P]
Rx13_P: J1.118 ; port AMC_P2P.Rx13_N  [project net AMC_P2P.Rx13_N]
Rx14_N: J1.123 ; port AMC_P2P.Rx14_P  [project net AMC_P2P.Rx14_P]
Rx14_P: J1.124 ; port AMC_P2P.Rx14_N  [project net AMC_P2P.Rx14_N]
Rx15_N: J1.129 ; port AMC_P2P.Rx15_P  [project net AMC_P2P.Rx15_P]
Rx15_P: J1.130 ; port AMC_P2P.Rx15_N  [project net AMC_P2P.Rx15_N]
Rx17_N: J1.141 ; port MLVDS_AMC_PORTS.Rx17_N  [project net MLVDS_AMC_PORTS.Rx17_N]
Rx17_P: J1.142 ; port MLVDS_AMC_PORTS.Rx17_P  [project net MLVDS_AMC_PORTS.Rx17_P]
Rx18_N: J1.147 ; port MLVDS_AMC_PORTS.Rx18_N  [project net MLVDS_AMC_PORTS.Rx18_N]
Rx18_P: J1.148 ; port MLVDS_AMC_PORTS.Rx18_P  [project net MLVDS_AMC_PORTS.Rx18_P]
Rx19_N: J1.153 ; port MLVDS_AMC_PORTS.Rx19_N  [project net MLVDS_AMC_PORTS.Rx19_N]
Rx19_P: J1.154 ; port MLVDS_AMC_PORTS.Rx19_P  [project net MLVDS_AMC_PORTS.Rx19_P]
Rx20_N: J1.159 ; port MLVDS_AMC_PORTS.Rx20_N  [project net MLVDS_AMC_PORTS.Rx20_N]
Rx20_P: J1.160 ; port MLVDS_AMC_PORTS.Rx20_P  [project net MLVDS_AMC_PORTS.Rx20_P]
SCL_L: J1.56 ; port IPMB.SCL_L  [project net IPMB.SCL_L]
SDA_L: J1.71 ; port IPMB.SDA_L  [project net IPMB.SDA_L]
TCLKA_N: J1.75 ; port AMC_TELECOM_CLK.TCLKA_N
TCLKA_P: J1.74 ; port AMC_TELECOM_CLK.TCLKA_P
TCLKB_N: J1.78 ; port AMC_TELECOM_CLK.TCLKB_N
TCLKB_P: J1.77 ; port AMC_TELECOM_CLK.TCLKB_P
TCLKC_N: J1.135 ; port AMC_TELECOM_CLK.TCLKC_N
TCLKC_P: J1.136 ; port AMC_TELECOM_CLK.TCLKC_P
TCLKD_N: J1.138 ; port AMC_TELECOM_CLK.TCLKD_N
TCLKD_P: J1.139 ; port AMC_TELECOM_CLK.TCLKD_P
Tx0_N: J1.12 ; port PORT0.Tx0_N  [project net PORT0.Tx0_N]
Tx0_P: J1.11 ; port PORT0.Tx0_P  [project net PORT0.Tx0_P]
Tx1_N: J1.21 ; port PORT1.Tx1_N
Tx1_P: J1.20 ; port PORT1.Tx1_P
Tx2_N: J1.30 ; port PORT2.Tx2_N
Tx2_P: J1.29 ; port PORT2.Tx2_P
Tx3_N: J1.36 ; port PORT3.Tx3_N
Tx3_P: J1.35 ; port PORT3.Tx3_P
Tx4_N: J1.45 ; port FAT_PIPE1.Tx4_N  [project net FAT_PIPE1.Tx4_N]
Tx4_P: J1.44 ; port FAT_PIPE1.Tx4_P  [project net FAT_PIPE1.Tx4_P]
Tx5_N: J1.51 ; port FAT_PIPE1.Tx5_N  [project net FAT_PIPE1.Tx5_N]
Tx5_P: J1.50 ; port FAT_PIPE1.Tx5_P  [project net FAT_PIPE1.Tx5_P]
Tx6_N: J1.60 ; port FAT_PIPE1.Tx6_N  [project net FAT_PIPE1.Tx6_N]
Tx6_P: J1.59 ; port FAT_PIPE1.Tx6_P  [project net FAT_PIPE1.Tx6_P]
Tx7_N: J1.66 ; port FAT_PIPE1.Tx7_N  [project net FAT_PIPE1.Tx7_N]
Tx7_P: J1.65 ; port FAT_PIPE1.Tx7_P  [project net FAT_PIPE1.Tx7_P]
Tx8_N: J1.90 ; port FAT_PIPE2.Tx8_N
Tx8_P: J1.91 ; port FAT_PIPE2.Tx8_P
Tx9_N: J1.96 ; port FAT_PIPE2.Tx9_N
Tx9_P: J1.97 ; port FAT_PIPE2.Tx9_P
Tx10_N: J1.102 ; port FAT_PIPE2.Tx10_N
Tx10_P: J1.103 ; port FAT_PIPE2.Tx10_P
Tx11_N: J1.108 ; port FAT_PIPE2.Tx11_N
Tx11_P: J1.109 ; port FAT_PIPE2.Tx11_P
Tx12_N: J1.114 ; port AMC_P2P.Tx12_N  [project net AMC_P2P.Tx12_N]
Tx12_P: J1.115 ; port AMC_P2P.Tx12_P  [project net AMC_P2P.Tx12_P]
Tx13_N: J1.120 ; port AMC_P2P.Tx13_N  [project net AMC_P2P.Tx13_N]
Tx13_P: J1.121 ; port AMC_P2P.Tx13_P  [project net AMC_P2P.Tx13_P]
Tx14_N: J1.126 ; port AMC_P2P.Tx14_N  [project net AMC_P2P.Tx14_N]
Tx14_P: J1.127 ; port AMC_P2P.Tx14_P  [project net AMC_P2P.Tx14_P]
Tx15_N: J1.132 ; port AMC_P2P.Tx15_N  [project net AMC_P2P.Tx15_N]
Tx15_P: J1.133 ; port AMC_P2P.Tx15_P  [project net AMC_P2P.Tx15_P]
Tx17_N: J1.144 ; port MLVDS_AMC_PORTS.Tx17_N  [project net MLVDS_AMC_PORTS.Tx17_N]
Tx17_P: J1.145 ; port MLVDS_AMC_PORTS.Tx17_P  [project net MLVDS_AMC_PORTS.Tx17_P]
Tx18_N: J1.150 ; port MLVDS_AMC_PORTS.Tx18_N  [project net MLVDS_AMC_PORTS.Tx18_N]
Tx18_P: J1.151 ; port MLVDS_AMC_PORTS.Tx18_P  [project net MLVDS_AMC_PORTS.Tx18_P]
Tx19_N: J1.156 ; port MLVDS_AMC_PORTS.Tx19_N  [project net MLVDS_AMC_PORTS.Tx19_N]
Tx19_P: J1.157 ; port MLVDS_AMC_PORTS.Tx19_P  [project net MLVDS_AMC_PORTS.Tx19_P]
Tx20_N: J1.162 ; port MLVDS_AMC_PORTS.Tx20_N  [project net MLVDS_AMC_PORTS.Tx20_N]
Tx20_P: J1.163 ; port MLVDS_AMC_PORTS.Tx20_P  [project net MLVDS_AMC_PORTS.Tx20_P]
NetJ1_6: J1.6 ; port RSVD6
NetJ1_8: J1.8 ; port RSVD8

Not connected (* = marked no-connect by the designer): J1 171* 172* 173* 174* 175* 176* 177* 178* 179* 180* 181* 182* 183* 184* 185* 186* 187* 188* 189* 190* 191* 192* 193* 194* 195* 196* 197* 198* 199* 200* 201* 202* 203* 204* 205* 206* 207* 208* 209* 210* 211* 212* 213* 214* 215* 216* 217* 218* 219* 220* 221* 222* 223* 224* 225* 226* 227* 228* 229* 230* 231* 232* 233* 234* 235* 236* 237* 238* 239* 240* 241* 242* 243* 244* 245* 246* 247* 248* 249* 250* 251* 252* 253* 254* 255* 256* 257* 258* 259* 260* 261* 262* 263* 264* 265* 266* 267* 268* 269* 270* 271* 272* 273* 274*

### Layout directives
differential pair: MLVDS_AMC_PORTS.Rx17_N, MLVDS_AMC_PORTS.Rx17_P, MLVDS_AMC_PORTS.Rx18_N, MLVDS_AMC_PORTS.Rx18_P, MLVDS_AMC_PORTS.Rx19_N, MLVDS_AMC_PORTS.Rx19_P, MLVDS_AMC_PORTS.Rx20_N, MLVDS_AMC_PORTS.Rx20_P, MLVDS_AMC_PORTS.Tx17_N, MLVDS_AMC_PORTS.Tx17_P, MLVDS_AMC_PORTS.Tx18_N, MLVDS_AMC_PORTS.Tx18_P, MLVDS_AMC_PORTS.Tx19_N, MLVDS_AMC_PORTS.Tx19_P, MLVDS_AMC_PORTS.Tx20_N, MLVDS_AMC_PORTS.Tx20_P
differential pair; differential pair class Diff_100Ohm: AMC_FABRIC_CLOCK.FCLKA_N, AMC_FABRIC_CLOCK.FCLKA_P, AMC_P2P.Rx12_N, AMC_P2P.Rx12_P, AMC_P2P.Rx13_N, AMC_P2P.Rx13_P, AMC_P2P.Rx14_N, AMC_P2P.Rx14_P, AMC_P2P.Rx15_N, AMC_P2P.Rx15_P, AMC_P2P.Tx12_N, AMC_P2P.Tx12_P, AMC_P2P.Tx13_N, AMC_P2P.Tx13_P, AMC_P2P.Tx14_N, AMC_P2P.Tx14_P, AMC_P2P.Tx15_N, AMC_P2P.Tx15_P, FAT_PIPE1.Rx4_N, FAT_PIPE1.Rx4_P, FAT_PIPE1.Rx5_N, FAT_PIPE1.Rx5_P, FAT_PIPE1.Rx6_N, FAT_PIPE1.Rx6_P, FAT_PIPE1.Rx7_N, FAT_PIPE1.Rx7_P, FAT_PIPE1.Tx4_N, FAT_PIPE1.Tx4_P, FAT_PIPE1.Tx5_N, FAT_PIPE1.Tx5_P, FAT_PIPE1.Tx6_N, FAT_PIPE1.Tx6_P, FAT_PIPE1.Tx7_N, FAT_PIPE1.Tx7_P, PORT0.Rx0_N, PORT0.Rx0_P, PORT0.Tx0_N, PORT0.Tx0_P, Rx1_N, Rx1_P, Rx2_N, Rx2_P, Rx3_N, Rx3_P, Rx8_N, Rx8_P, Rx9_N, Rx9_P, Rx10_N, Rx10_P, Rx11_N, Rx11_P, TCLKA_N, TCLKA_P, TCLKB_N, TCLKB_P, TCLKC_N, TCLKC_P, TCLKD_N, TCLKD_P, Tx1_N, Tx1_P, Tx2_N, Tx2_P, Tx3_N, Tx3_P, Tx8_N, Tx8_P, Tx9_N, Tx9_P, Tx10_N, Tx10_P, Tx11_N, Tx11_P

### Notes on the sheet
- Tx0
- Rx0
- Tx2
- Rx2
- TCLKA
- Tx1
- Rx1
- Tx3
- Rx3
- TCLKD
- TCLKB
- Tx4
- Rx4
- TCLKC
- Tx5
- Rx5
- Tx6
- Rx7
- Rx6
- Tx7
- Tx8
- Rx9
- Rx8
- Tx17
- Rx17
- Tx9
- Rx10
- Tx18
- Rx18
- Tx11
- Tx10
- Rx11
- Tx19
- Rx20
- Rx19
- Tx20
- RSRVD6
- RSRVD8
- NC
- Copyright CNPEM 2012.
- (http://ohwr.org/CERNOHL). This documentation is
- terms of the CERN OHL v.1.1.
- redistribute and modify this documentation under the
- licensed under the CERN OHL v.1.1. You may
- This documentation describes Open Hardware and is
- conditions.
- Please see the CERN OHL v.1.1 for applicable
- AND FITNESS FOR A PARTICULAR PURPOSE.
- MERCHANTABILITY, SATISFACTORY QUALITY
- WARRANTY, INCLUDING OF
- distributed WITHOUT ANY EXPRESS OR IMPLIED
- Project/Equipment
- Document
- Designer
- Drawn by
- Check.by
- File
- Last Mod.
- Print Date
- Sheet
- Size
- A3
- of
- Rev

### Library data of the parts
D1 = BAT165: as D29 on sheet USB_SERIAL_QUAD; Manufacturer Part Number: BAT165; PackageDescription: Small Outline Diode (SOD-323), 1.70mm W X 1.25mm L X 1.10mm H body,  IPC Medium Density; Part Number: BAT165; Component Kind: Standard; Component Type: Standard; Device: BAT165; Pin Count: 2; Case: SOD323; Mounted: Yes; Socket: No; SMD: Yes; Sense: No; ComponentHeight: 1.1mm; HelpURL: \\cern.ch\dfs\Applications\Altium\Datasheets\BAT165.pdf; Author: CERN DEM JLC; CreateDate: 12.11.2014; LatestRevisionDate: 12.11.2014
J1 = CMP-0001-00058-2: Golden finger, AMC, Dual, Opposite, Pitch 0.75mm, 170-Position; Package Version: rev2.0, Nov-2006; Mating Connector: Molex-0758000001; Datasheet Version: rev2.0, Nov-2006; ClassName: Edge Connector; Package Reference: AMC-GF-2D-750-O274; Publisher: Altium